# EAGLE design TestPressureSensor (EAGLE 9.6.2)
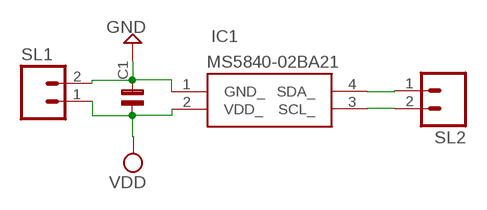
[diagram p0: schematic, sheet 1]

## Parts
C1  C0805  [0805]
IC1  MS5840-02BA21  [MS584002BA21]
SL1  M02  [02P]
SL2  M02  [02P]

## Nets
GND: C1.2 IC1.1(GND_) SL1.2
N$1: IC1.4(SDA_) SL2.1
N$2: IC1.3(SCL_) SL2.2
VDD: C1.1 IC1.2(VDD_) SL1.1

## Library data of the parts
C1 = capsmd:C0805
IC1 = TeConnectivity:MS5840-02BA21: Board Mount Pressure Sensors LP PRESS SENSOR T&R Source: Datasheet <https://www.mouser.com/datasheet/2/418/NG_DS_MS5840-02BA_A1-1532019.pdf>; DESCRIPTION: Board Mount Pressure Sensors LP PRESS SENSOR T&R; HEIGHT: 1.7mm; MANUFACTURER_NAME: TE Connectivity; MANUFACTURER_PART_NUMBER: MS5840-02BA21; TE_INTERNAL_PART_NUMBER: 20000980-00; TE_PRICE-STOCK: https://www.te.com/usa-en/product-20000980-00.html
SL1 SL2 = con-amp-quick:M02: AMP QUICK CONNECTOR; OC_FARNELL: unknown; OC_NEWARK: unknown

## Board
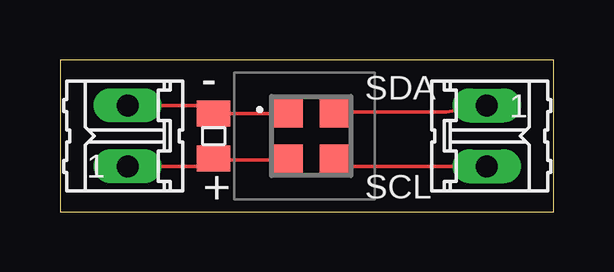
[diagram p1: board, top side]
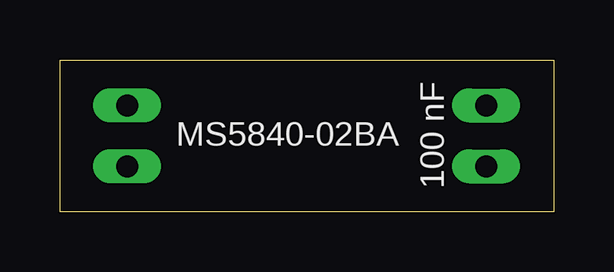
[diagram p2: board, bottom side, seen from below]

Size 20.57 x 6.35 mm. Coordinates in mm from the lower left corner, seen from the top.
Outline: 0,0 20.57,0 20.57,6.35 0,6.35 0,0
Copper layers (1*16): Top 0.035mm / dielectric 1.5mm / Bottom 0.035mm
Design rules "default": minimum track width 6mil, minimum drill 0.35mm, track to track 6mil, track to pad 6mil, pad to pad 6mil, via to via 6mil, smd to smd 6mil, copper to edge 40mil, drill to drill 6mil, minimum pad ring 10mil, minimum via ring 8mil, stop-mask expansion 4mil, vias tented up to drill 0mil, thermal gap 10mil

### Footprints (pad centres in the part's own frame; a part is rotated, then mirrored left to right if it is on the bottom)
0805 = smd 1.092 x 1.397: 1 -0.94,0; 2 0.94,0
MS584002BA21 = smd 1.3 x 1.3: 1 -1,1; 2 -1,-1; 3 1,-1; 4 1,1
02P = drill 0.914 long: 1 -1.27,0; 2 1.27,0

### Placement (x,y rotation side)
C1  6.4,3.17 90 top
IC1  10.47,3.17 0 top
SL1  2.82,3.17 90 top
SL2  17.78,3.17 270 top

### Tracks (layer width: path | path; a pad name or v marks a point on that pad's centre or on a via)
GND
  Top 0.152: SL1.2 6.07,4.45 C1.2 9.41,4.12 IC1.1
N$1
  Top 0.152: IC1.4 16.1,4.18 SL2.1
N$2
  Top 0.152: SL2.2 11.74,1.91 IC1.3
VDD
  Top 0.152: IC1.2 6.46,2.18 C1.1 6.07,1.91 SL1.1

### Text on the board
tPlace: - | SDA | SCL | +
bPlace: 100 nF | MS5840-02BA